# EAGLE design G021K-E (EAGLE 6.6.0)
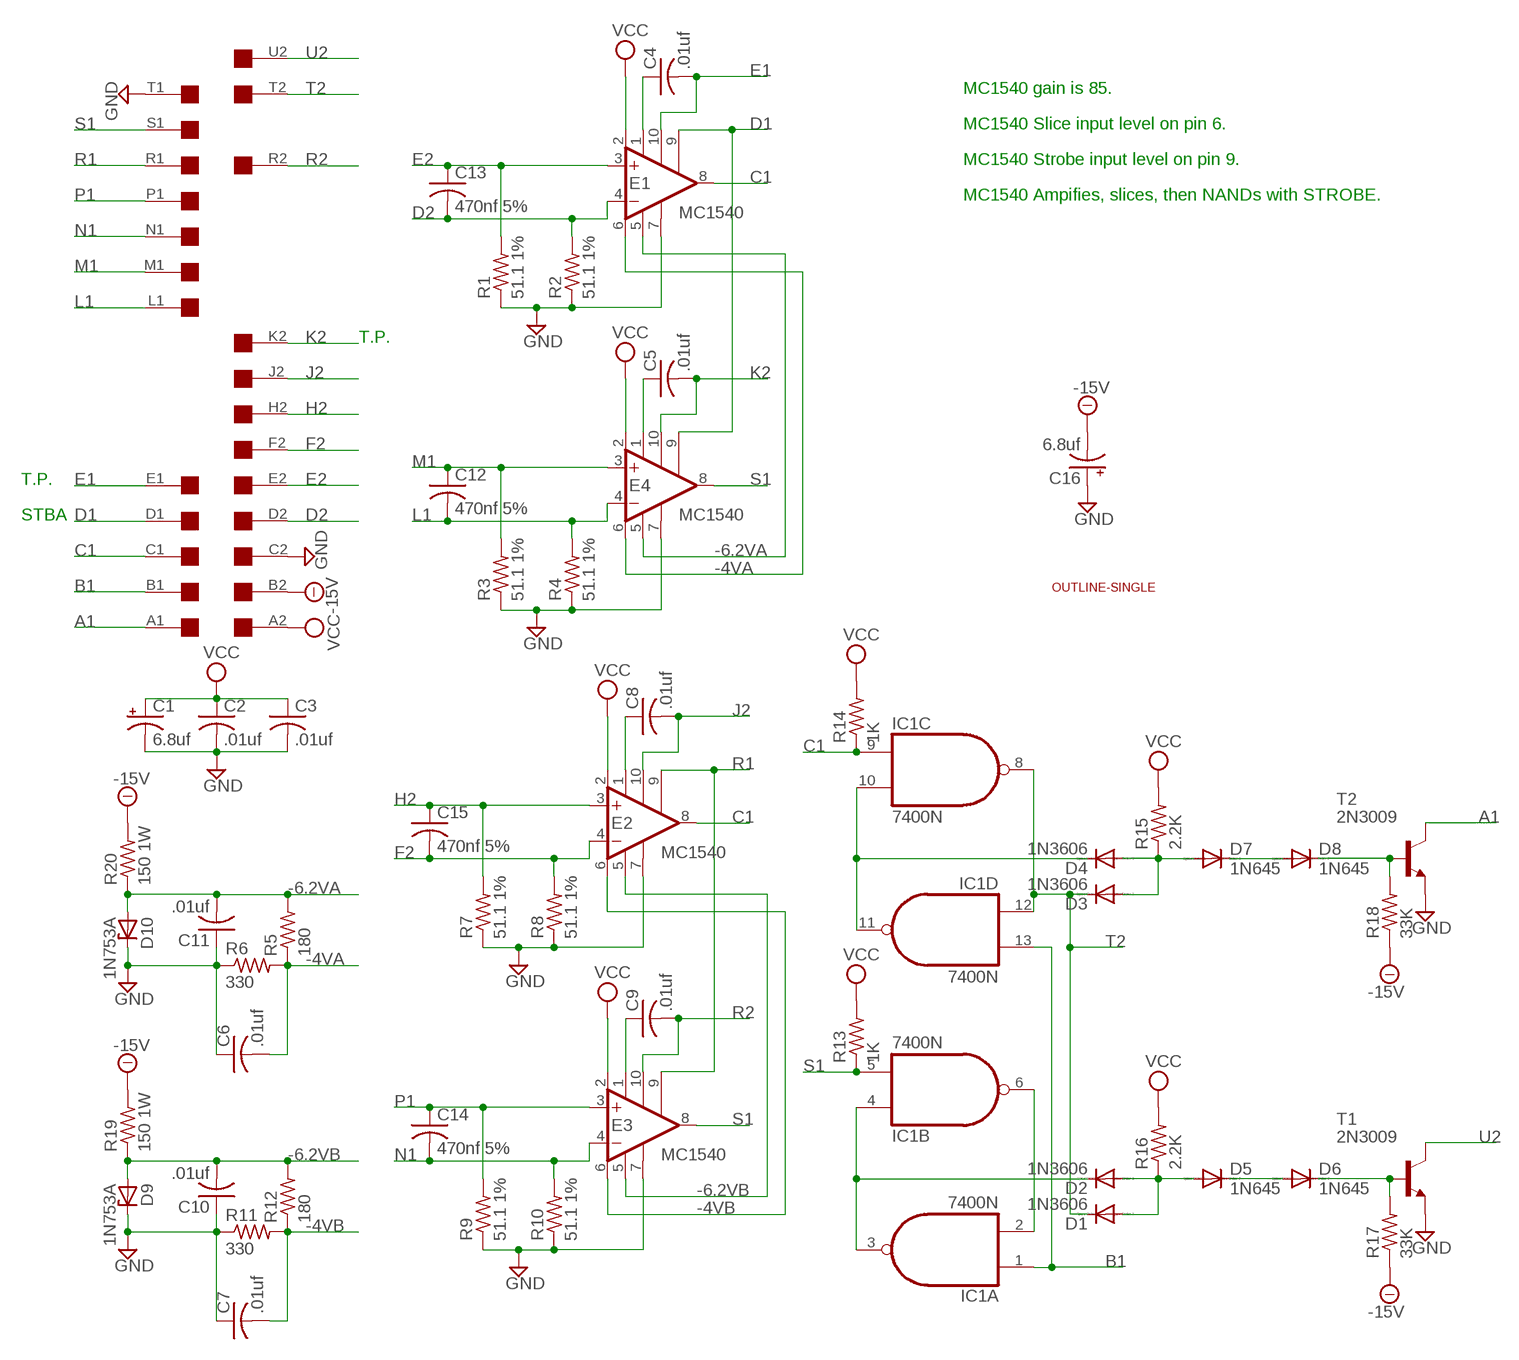
[diagram p0: schematic, sheet 1]

## Parts
C1  6.8uf  CPOL-USE15-5AXIAL  [E15-5]
C2  .01uf  C-US050-025X075  [C050-025X075]
C3  .01uf  C-US050-025X075  [C050-025X075]
C4  .01uf  C-US050-025X075  [C050-025X075]
C5  .01uf  C-US050-025X075  [C050-025X075]
C6  .01uf  C-US050-025X075  [C050-025X075]
C7  .01uf  C-US050-025X075  [C050-025X075]
C8  .01uf  C-US050-025X075  [C050-025X075]
C9  .01uf  C-US050-025X075  [C050-025X075]
C10  .01uf  C-US050-025X075  [C050-025X075]
C11  .01uf  C-US050-025X075  [C050-025X075]
C12  470nf 5%  C-US050-025X075  [C050-025X075]
C13  470nf 5%  C-US050-025X075  [C050-025X075]
C14  470nf 5%  C-US050-025X075  [C050-025X075]
C15  470nf 5%  C-US050-025X075  [C050-025X075]
C16  6.8uf  CPOL-USE15-5AXIAL  [E15-5]
D1  1N3606  1N4148DO35-10  [DO35-10]
D2  1N3606  1N4148DO35-10  [DO35-10]
D3  1N3606  1N4148DO35-10  [DO35-10]
D4  1N3606  1N4148DO35-10  [DO35-10]
D5  1N645  1N4148DO35-10  [DO35-10]
D6  1N645  1N4148DO35-10  [DO35-10]
D7  1N645  1N4148DO35-10  [DO35-10]
D8  1N645  1N4148DO35-10  [DO35-10]
D9  1N753A  ZENER-DIODEF126-10  [F126Z10]
D10  1N753A  ZENER-DIODEF126-10  [F126Z10]
E1  MC1540  MC1540G  [602B]
E2  MC1540  MC1540G  [602B]
E3  MC1540  MC1540G  [602B]
E4  MC1540  MC1540G  [602B]
IC1  7400N  [DIL14]
R1  51.1 1%  R-US_0207/10  [0207/10]
R2  51.1 1%  R-US_0207/10  [0207/10]
R3  51.1 1%  R-US_0207/10  [0207/10]
R4  51.1 1%  R-US_0207/10  [0207/10]
R5  180  R-US_0207/10  [0207/10]
R6  330  R-US_0207/10  [0207/10]
R7  51.1 1%  R-US_0207/10  [0207/10]
R8  51.1 1%  R-US_0207/10  [0207/10]
R9  51.1 1%  R-US_0207/10  [0207/10]
R10  51.1 1%  R-US_0207/10  [0207/10]
R11  330  R-US_0207/10  [0207/10]
R12  180  R-US_0207/10  [0207/10]
R13  1K  R-US_0207/10  [0207/10]
R14  1K  R-US_0207/10  [0207/10]
R15  2.2K  R-US_0207/10  [0207/10]
R16  2.2K  R-US_0207/10  [0207/10]
R17  33K  R-US_0207/10  [0207/10]
R18  33K  R-US_0207/10  [0207/10]
R19  150 1W  R-US_0414/15  [0414/15]
R20  150 1W  R-US_0414/15  [0414/15]
T1  2N3009  2N3565  [TO92]
T2  2N3009  2N3565  [TO92]
U$1  SINGLE  [EDGE-CON2]
U$2  OUTLINE-SINGLE  [SINGLE]

## Nets
-4VA: C6.2 E1.6(SLICE) E4.6(SLICE) R5.1 R6.2
-4VB: C7.2 E2.6(SLICE) E3.6(SLICE) R11.2 R12.1
-6.2VA: C11.2 D10.A E1.5(V-) E4.5(V-) R5.2 R20.1
-6.2VB: C10.2 D9.A E2.5(V-) E3.5(V-) R12.2 R19.1
-15V: C16.- R17.1 R18.1 R19.2 R20.2 U$1.B2
A1: T2.1(C) U$1.A1
B1: IC1.1(A:I0) IC1.13(D:I1) U$1.B1
C1: E1.8(OUT) E2.8(OUT) IC1.9(C:I0) R14.1 U$1.C1
D1: E1.9(ISTROBE) E4.9(ISTROBE) U$1.D1
D2: C13.2 E1.4(-IN) R2.2 U$1.D2
E1: C4.2 E1.10(CEXTB) U$1.E1
E2: C13.1 E1.3(+IN) R1.2 U$1.E2
F2: C15.2 E2.4(-IN) R8.2 U$1.F2
GND: C1.- C2.2 C3.2 C6.1 C7.1 C10.1 C11.1 C16.+ D9.C D10.C E1.7(GND) E2.7(GND) E3.7(GND) E4.7(GND) R1.1 R2.1 R3.1 R4.1 R6.1 R7.1 R8.1 R9.1 R10.1 R11.1 T1.3(E) T2.3(E) U$1.C2 U$1.T1
H2: C15.1 E2.3(+IN) R7.2 U$1.H2
J2: C8.2 E2.10(CEXTB) U$1.J2
K2: C5.2 E4.10(CEXTB) U$1.K2
L1: C12.2 E4.4(-IN) R4.2 U$1.L1
M1: C12.1 E4.3(+IN) R3.2 U$1.M1
N1: C14.2 E3.4(-IN) R10.2 U$1.N1
N$1: C4.1 E1.1(CEXTA)
N$2: C8.1 E2.1(CEXTA)
N$3: C5.1 E4.1(CEXTA)
N$4: C9.1 E3.1(CEXTA)
N$6: D1.A D2.A D5.A R16.1
N$7: D4.C IC1.10(C:I1) IC1.11(D:O)
N$8: D2.C IC1.3(A:O) IC1.4(B:I0)
N$9: IC1.2(A:I1) IC1.6(B:O)
N$10: D3.A D4.A D7.A R15.1
N$11: D7.C D8.A
N$12: D5.C D6.A
N$13: D8.C R18.2 T2.2(B)
N$14: D6.C R17.2 T1.2(B)
P1: C14.1 E3.3(+IN) R9.2 U$1.P1
R1: E2.9(ISTROBE) E3.9(ISTROBE) U$1.R1
R2: C9.2 E3.10(CEXTB) U$1.R2
S1: E3.8(OUT) E4.8(OUT) IC1.5(B:I1) R13.1 U$1.S1
T2: D1.C D3.C IC1.8(C:O) IC1.12(D:I0) U$1.T2
U2: T1.1(C) U$1.U2
VCC: C1.+ C2.1 C3.1 E1.2(V+) E2.2(V+) E3.2(V+) E4.2(V+) R13.2 R14.2 R15.2 R16.2 U$1.A2
Unconnected: U$1.F1 U$1.H1 U$1.J1 U$1.K1 U$1.L2 U$1.M2 U$1.N2 U$1.P2 U$1.S2 U$1.U1 U$1.V1 U$1.V2

## Notes on the sheet
- MC1540 gain is 85.
- MC1540 Slice input level on pin 6.
- MC1540 Strobe input level on pin 9.
- MC1540 Ampifies, slices, then NANDs with STROBE.
- T.P.
- T.P.
- STBA

## Power pins joined to a net without a drawn wire
GND: IC1.7(P:GND)
VCC: IC1.14(P:VCC)

## Library data of the parts
C1 C16 = rcl:CPOL-US: POLARIZED CAPACITOR, American symbol
C2-C15 = rcl:C-US: CAPACITOR, American symbol
D1-D8 = diode:1N4148: DIODE high speed (Philips)
D9 D10 = diode:ZENER-DIODE: Z-Diode
E1-E4 = dec-con:MC1540: OP AMP
IC1 = 74xx-us:74*00: Quad 2-input NAND gate
R1-R20 = rcl:R-US_: RESISTOR, American symbol
T1 T2 = transistor:2N3565: NPN TRANSISTOR
U$1 = dec-con:SINGLE: Single-Height DEC board
U$2 = dec-con:OUTLINE-*: Board outlines for DEC boards.

## Board
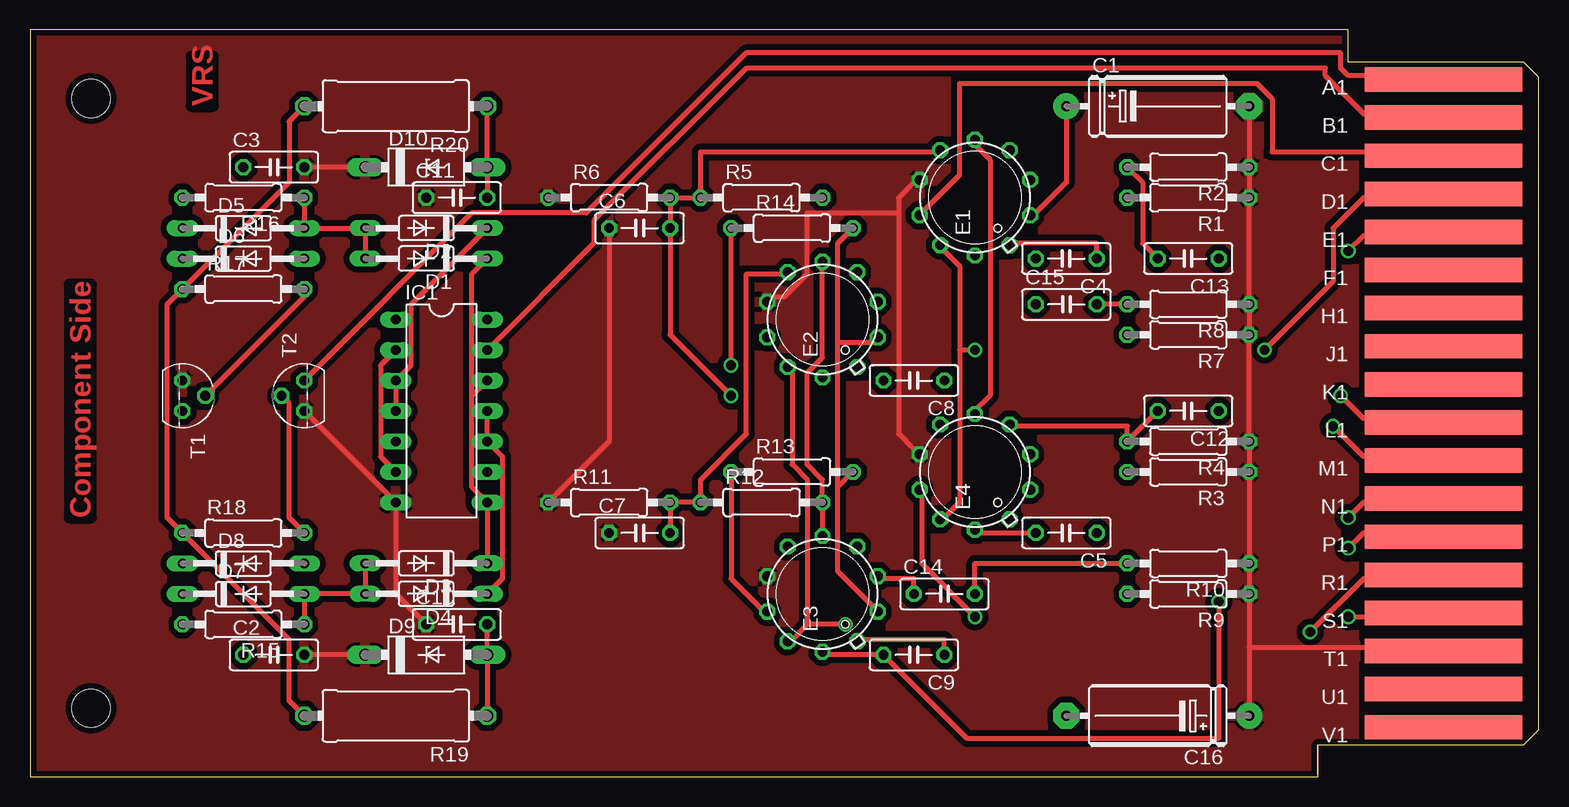
[diagram p1: board, top side]
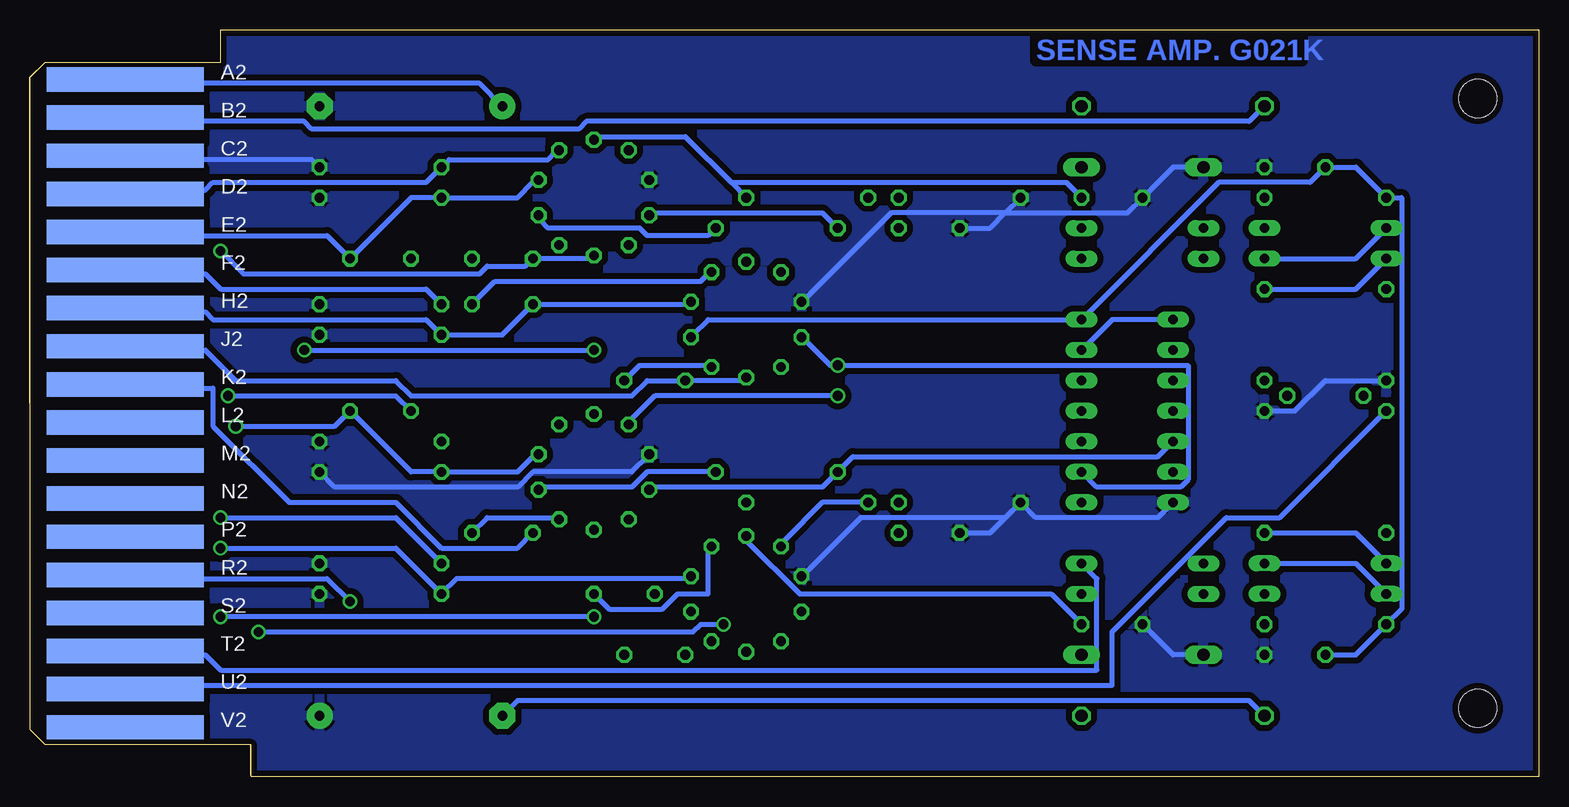
[diagram p2: board, bottom side, seen from below]

Size 125.73 x 62.23 mm. Coordinates in mm from the lower left corner, seen from the top.
Copper layers (1+16): Top 0.035mm / dielectric 1.5mm / Bottom 0.035mm
Design rules "16mils": minimum track width 16mil, minimum drill 32mil, track to track 15mil, track to pad 10mil, pad to pad 10mil, via to via 10mil, smd to smd 10mil, copper to edge 13mil, drill to drill 10mil, minimum pad ring 10mil, minimum via ring 8mil, stop-mask expansion 0mil, vias tented up to drill 0mil, thermal gap 10mil

### Footprints (pad centres in the part's own frame; a part is rotated, then mirrored left to right if it is on the bottom)
E15-5 = drill 0.813 pad 2.159: + -7.62,0 | drill 0.813 pad 2.159 octagon: - 7.62,0
C050-025X075 = drill 0.813 octagon: 1 -2.54,0; 2 2.54,0
DO35-10 = drill 0.813 long: A 5.08,0; C -5.08,0
F126Z10 = drill 1.016 long: A 5.08,0; C -5.08,0
602B = drill 0.813 octagon: 1 -3.954,-2.897; 2 -1.478,-4.605; 3 1.478,-4.605; 4 3.954,-2.897; 5 4.825,0; 6 3.954,2.897; 7 1.478,4.605; 8 -1.477,4.605; 9 -3.954,2.897; 10 -4.825,0
DIL14 = drill 0.813 long: 1 -7.62,-3.81; 2 -5.08,-3.81; 3 -2.54,-3.81; 4 0,-3.81; 5 2.54,-3.81; 6 5.08,-3.81; 7 7.62,-3.81; 8 7.62,3.81; 9 5.08,3.81; 10 2.54,3.81; 11 0,3.81; 12 -2.54,3.81; 13 -5.08,3.81; 14 -7.62,3.81
0207/10 = drill 0.813 octagon: 1 -5.08,0; 2 5.08,0
0414/15 = drill 1.016 octagon: 1 -7.62,0; 2 7.62,0
TO92 = drill 0.813 octagon: 1 1.27,0; 2 0,1.905; 3 -1.27,0
EDGE-CON2 = smd 13.106 x 2.032: A1 7.938,4.128; B1 7.938,7.303; C1 7.938,10.477; D1 7.938,13.652; E1 7.938,16.828; F1 7.938,20.003; H1 7.938,23.177; J1 7.938,26.352; K1 7.938,29.527; L1 7.938,32.703; M1 7.938,35.877; N1 7.938,39.053; P1 7.938,42.227; R1 7.938,45.403; S1 7.938,48.578; T1 7.938,51.752; U1 7.938,54.928; V1 7.938,58.102 | smd 13.106 x 2.032 bottom: A2 7.938,4.128; B2 7.938,7.303; C2 7.938,10.477; D2 7.938,13.652; E2 7.938,16.828; F2 7.938,20.003; H2 7.938,23.177; J2 7.938,26.352; K2 7.938,29.527; L2 7.938,32.703; M2 7.938,35.877; N2 7.938,39.053; P2 7.938,42.227; R2 7.938,45.403; S2 7.938,48.578; T2 7.938,51.752; U2 7.938,54.928; V2 7.938,58.102
SINGLE = hole 3.175: 120.65,56.515; 120.65,5.715

### Placement (x,y rotation side)
C1  93.98,55.88 0 top
C2  20.32,10.16 0 top
C3  20.32,50.8 0 top
C4  86.36,43.18 180 top
C5  86.36,20.32 180 top
C6  50.8,45.72 0 top
C7  50.8,20.32 0 top
C8  73.66,33.02 180 top
C9  73.66,10.16 180 top
C10  35.56,12.7 0 top
C11  35.56,48.26 0 top
C12  96.52,30.48 180 top
C13  96.52,43.18 180 top
C14  76.2,15.24 0 top
C15  86.36,39.37 0 top
C16  93.98,5.08 180 top
D1  33.02,43.18 180 top
D2  33.02,45.72 180 top
D3  33.02,17.78 180 top
D4  33.02,15.24 180 top
D5  17.78,45.72 0 top
D6  17.78,43.18 0 top
D7  17.78,15.24 0 top
D8  17.78,17.78 0 top
D9  33.02,10.16 0 top
D10  33.02,50.8 0 top
E1  78.74,48.26 90 top
E2  66.04,38.1 90 top
E3  66.04,15.24 90 top
E4  78.74,25.4 90 top
IC1  34.29,30.48 270 top
R1  96.52,48.26 180 top
R2  96.52,50.8 180 top
R3  96.52,25.4 180 top
R4  96.52,27.94 180 top
R5  60.96,48.26 0 top
R6  48.26,48.26 0 top
R7  96.52,36.83 180 top
R8  96.52,39.37 180 top
R9  96.52,15.24 180 top
R10  96.52,17.78 180 top
R11  48.26,22.86 0 top
R12  60.96,22.86 0 top
R13  63.5,25.4 0 top
R14  63.5,45.72 0 top
R15  17.78,12.7 180 top
R16  17.78,48.26 180 top
R17  17.78,40.64 0 top
R18  17.78,20.32 0 top
R19  30.48,5.08 180 top
R20  30.48,55.88 180 top
T1  12.7,31.75 270 top
T2  22.86,31.75 90 top
U$1  125.73,62.23 180 top
U$2  125.73,62.23 180 top

### Tracks (layer width: path | path; a pad name or v marks a point on that pad's centre or on a via)
-4VA  (via drill 0.81)
  Top 0.406: v58.42,31.75 53.34,36.83 C6.2 R6.2 R5.1 55.88,52.07 75.56,52.07 E1.6
  Bottom 0.406: v58.42,31.75 73.66,31.75 75.56,29.84 E4.6
-4VB
  Top 0.406: C7.2 R11.2 R12.1 55.88,24.77 59.69,28.57 59.69,41.91 62.87,41.91 E2.6
  Bottom 0.406: R12.1 59.69,22.86 62.87,19.68 E3.6
-6.2VA
  Top 0.406: C11.2 D10.A R20.1 | E4.5 78.74,30.48 80.01,31.75 80.01,51.44 78.74,52.7 E1.5
  Bottom 0.406: 67.31,49.53 71.12,53.34 78.74,53.34 E1.5 | 67.31,49.53 R5.2 | C11.2 39.37,49.53 67.31,49.53
-6.2VB
  Top 0.406: C10.2 D9.A R19.1 | E3.5 R12.2 66.04,24.77 64.77,26.04 64.77,33.66 66.04,34.92 E2.5
  Bottom 0.406: C10.2 40.64,15.24 61.59,15.24 66.04,19.68 E3.5
-15V
  Top 0.406: R20.2 21.59,54.61 21.59,49.53 R17.1 11.43,39.37 11.43,21.59 R18.1 21.59,11.43 21.59,6.35 R19.2
  Bottom 0.406: C16.- 85.09,6.35 24.13,6.35 R19.2 | R20.2 24.13,54.61 79.38,54.61 80.01,53.98 102.23,53.98 102.87,54.61 117.47,54.61 U$1.B2
A1
  Top 0.406: T2.1 36.83,46.99 46.35,46.99 59.69,60.33 109.22,60.33 109.22,59.05 109.86,58.42 117.47,58.42 U$1.A1
B1
  Top 0.406: IC1.13 46.99,44.45 46.99,46.35 59.69,59.05 107.95,59.05 107.95,58.42 111.12,55.24 117.47,55.24 U$1.B1
  Bottom 0.406: IC1.13 35.56,38.1 IC1.1
C1  (via drill 0.81)
  Top 0.406: v58.42,34.29 R14.1 | U$1.C1 117.47,52.07 103.5,52.07 103.5,56.52 102.23,57.78 77.47,57.78 77.47,50.16 74.3,46.99 E1.8
  Bottom 0.406: R14.1 59.69,46.99 73.66,46.99 E1.8 | IC1.9 36.83,24.13 29.84,24.13 29.21,24.77 29.21,34.29 v58.42,34.29 59.05,34.29 60.96,36.2 E2.8
D1  (via drill 0.81)
  Top 0.406: 77.47,35.56 77.47,42.55 76.2,43.81 E1.9 | 77.47,35.56 77.47,22.86 76.2,21.59 E4.9 | v78.74,35.56 77.47,35.56 | v102.87,35.56 108.58,41.27 108.58,45.72 111.12,48.26 117.47,48.26 U$1.D1
  Bottom 0.406: v102.87,35.56 v78.74,35.56
D2
  Top 0.406: C13.2 92.71,44.45 92.71,49.53 R2.2
  Bottom 0.406: E1.4 81.92,52.07 82.55,51.44 90.81,51.44 R2.2 92.71,49.53 110.49,49.53 111.12,48.9 117.47,48.9 U$1.D2
E1  (via drill 0.81)
  Top 0.406: v109.86,43.81 111.12,45.09 117.47,45.09 U$1.E1
  Bottom 0.406: E1.10 78.74,43.18 C4.2 84.45,42.55 87.63,42.55 88.27,41.91 107.95,41.91 v109.86,43.81
E2
  Bottom 0.406: E1.3 83.82,49.53 85.09,48.26 R1.2 93.98,48.26 C13.1 100.97,45.09 117.47,45.09 U$1.E2
F2
  Top 0.406: R8.2 C15.2
  Bottom 0.406: C15.2 87,41.27 69.85,41.27 69.22,41.91 E2.4 | R8.2 92.71,40.64 109.86,40.64 111.12,41.91 117.47,41.91 U$1.F2
GND
  Top 0.406: C1.- R2.1 R1.1 R8.1 R7.1 R4.1 R3.1 R10.1 R9.1 101.6,10.79 | 101.6,10.79 C16.+ | 101.6,10.79 117.47,10.79 U$1.T1 | D9.C C2.2 | T2.3 IC1.7 30.48,15.24 C10.1 | 72.39,46.99 72.39,48.26 73.66,49.53 E1.7 | 72.39,46.99 72.39,28.57 73.66,27.3 E4.7 | D10.C C3.2 | 72.39,46.99 64.77,46.99 64.77,41.91 62.87,40.01 61.59,40.01 E2.7 | R11.1 48.26,27.94 C6.1
  Bottom 0.406: R2.1 102.23,51.44 117.47,51.44 U$1.C2 | 44.45,21.59 45.72,20.32 C7.1 | 44.45,21.59 R11.1 41.91,21.59 31.75,21.59 IC1.7 | 44.45,21.59 56.52,21.59 60.96,17.14 E3.7 | C10.1 30.48,10.16 D9.C | T1.3 17.78,33.02 20.32,30.48 T2.3 | D10.C 30.48,50.8 C11.1 34.29,46.99 44.45,46.99 | 44.45,46.99 45.72,45.72 C6.1 | 44.45,46.99 R6.1 | 44.45,46.99 53.98,46.99 60.96,40.01 E2.7 | R3.1 100.33,24.13 85.09,24.13 83.82,25.4 75.56,25.4 74.3,26.67 E4.7
  pour Bottom (isolate 0.508): 0,0 110.49,0 110.49,62.23 0,62.23
  pour Top (isolate 0.508): 0,0 110.49,0 110.49,62.23 0,62.23
H2
  Bottom 0.406: E2.3 71.12,39.37 C15.1 86.36,36.83 R7.2 92.71,38.1 110.49,38.1 111.12,38.73 117.47,38.73 U$1.H2
J2
  Bottom 0.406: E2.10 66.04,33.02 C8.2 74.3,33.02 75.56,31.75 93.98,31.75 95.25,33.02 108.58,33.02 111.12,35.56 117.47,35.56 U$1.J2
K2
  Top 0.406: C5.2 78.74,20.32 E4.10
  Bottom 0.406: C5.2 85.09,19.05 91.44,19.05 95.25,22.86 104.14,22.86 110.49,29.21 110.49,32.38 117.47,32.38 U$1.K2
L1  (via drill 0.81)
  Top 0.406: E4.4 81.92,29.21 91.44,29.21 R4.2 C12.2 | v109.22,31.75 111.12,29.84 117.47,29.84 U$1.L1
  Bottom 0.406: C12.2 95.25,31.75 v109.22,31.75
M1  (via drill 0.81)
  Top 0.406: v108.58,29.21 111.12,26.67 117.47,26.67 U$1.M1
  Bottom 0.406: E4.3 83.82,26.67 85.09,25.4 R3.2 93.98,25.4 C12.1 100.33,29.21 v108.58,29.21
N1  (via drill 0.81)
  Top 0.406: R10.2 78.74,17.78 C14.2 | v109.86,21.59 111.12,22.86 117.47,22.86 U$1.N1
  Bottom 0.406: C14.2 77.47,13.97 73.03,13.97 71.75,15.24 69.22,15.24 69.22,19.05 E3.4 | R10.2 95.25,21.59 v109.86,21.59
N$1
  Top 0.406: C4.1 88.9,44.45 81.92,44.45 E1.1
N$2
  Bottom 0.406: C8.1 74.93,34.29 69.22,34.29 E2.1
N$3
  Bottom 0.406: C5.1 87.63,21.59 81.92,21.59 E4.1
N$4
  Top 0.406: C9.1 76.2,11.43 69.22,11.43 E3.1
N$6
  Top 0.406: D1.A D2.A D5.A R16.1
N$7
  Top 0.406: D4.C 39.37,16.51 39.37,26.67 IC1.10 IC1.11
N$8
  Top 0.406: IC1.4 IC1.3 31.75,34.29 31.75,39.37 D2.C
N$9
  Top 0.406: IC1.6 29.21,26.67 29.21,34.29 IC1.2
N$10
  Top 0.406: R15.1 D7.A D4.A D3.A
N$11
  Bottom 0.406: D7.C 15.24,17.78 D8.A
N$12
  Bottom 0.406: D5.C 15.24,43.18 D6.A
N$13
  Top 0.406: T2.2 21.59,31.11 21.59,21.59 R18.2
  Bottom 0.406: D8.C 15.24,20.32 R18.2
N$14
  Top 0.406: T1.2 22.86,40.01 R17.2
  Bottom 0.406: D6.C 15.24,40.64 R17.2
P1  (via drill 0.81)
  Top 0.406: C14.1 73.66,16.51 71.12,16.51 E3.3 | v109.86,19.05 111.12,20.32 117.47,20.32 U$1.P1
  Bottom 0.406: E3.3 71.12,16.51 90.17,16.51 R9.2 95.25,19.05 v109.86,19.05
R1  (via drill 0.81)
  Top 0.406: 64.77,12.7 63.5,11.43 E3.9 | 64.77,12.7 64.77,24.77 63.5,26.04 63.5,33.66 E2.9 | v67.94,12.7 64.77,12.7 | v106.68,12.06 111.12,16.51 117.47,16.51 U$1.R1
  Bottom 0.406: v67.94,12.7 69.85,12.7 70.48,12.06 v106.68,12.06
R2  (via drill 0.81)
  Top 0.406: E3.10 66.04,10.16 C9.2 78.11,3.17 99.06,3.17 v99.06,14.61
  Bottom 0.406: v99.06,14.61 100.97,16.51 117.47,16.51 U$1.R2
S1  (via drill 0.81)
  Top 0.406: R13.1 58.42,16.51 60.96,13.97 E3.8 | v109.86,13.34 117.47,13.34 U$1.S1 | v78.74,13.34 74.3,17.78 74.3,23.5 E4.8
  Bottom 0.406: IC1.5 31.75,26.67 57.15,26.67 R13.1 59.69,24.13 73.66,24.13 E4.8 | v78.74,13.34 v109.86,13.34
T2
  Top 0.406: D3.C IC1.8 36.83,24.13 36.83,31.75 | 36.83,31.75 IC1.12 | D1.C 36.83,41.91 36.83,31.75
  Bottom 0.406: D3.C 36.83,16.51 36.83,8.89 109.86,8.89 111.12,10.16 117.47,10.16 U$1.T2
U2
  Bottom 0.406: T1.1 21.59,21.59 26.04,21.59 35.56,12.06 35.56,7.62 117.47,7.62 U$1.U2
VCC
  Top 0.406: C1.+ 86.36,49.53 83.82,46.99 E1.2 | 67.31,24.13 R13.2 | 67.31,24.13 67.31,17.14 70.48,13.97 E3.2 | 67.31,36.2 70.48,36.2 E2.2 | 67.31,24.13 67.31,36.2 | R14.2 67.31,44.45 67.31,36.2
  Bottom 0.406: C2.1 15.24,10.16 R15.2 11.43,13.97 11.43,48.26 R16.2 15.24,50.8 C3.1 19.05,49.53 26.67,49.53 IC1.14 69.22,38.1 70.48,36.83 E2.2 | R13.2 74.3,25.4 75.56,24.13 83.19,24.13 E4.2 | R14.2 69.22,45.09 74.3,45.09 74.93,45.72 82.55,45.72 83.19,46.35 E1.2 | C1.+ 88.27,57.78 117.47,57.78 U$1.A2

### Text on the board
Top: VRS | Component Side
Bottom: SENSE AMP. G021K
Document: Layout is based onn G021E.